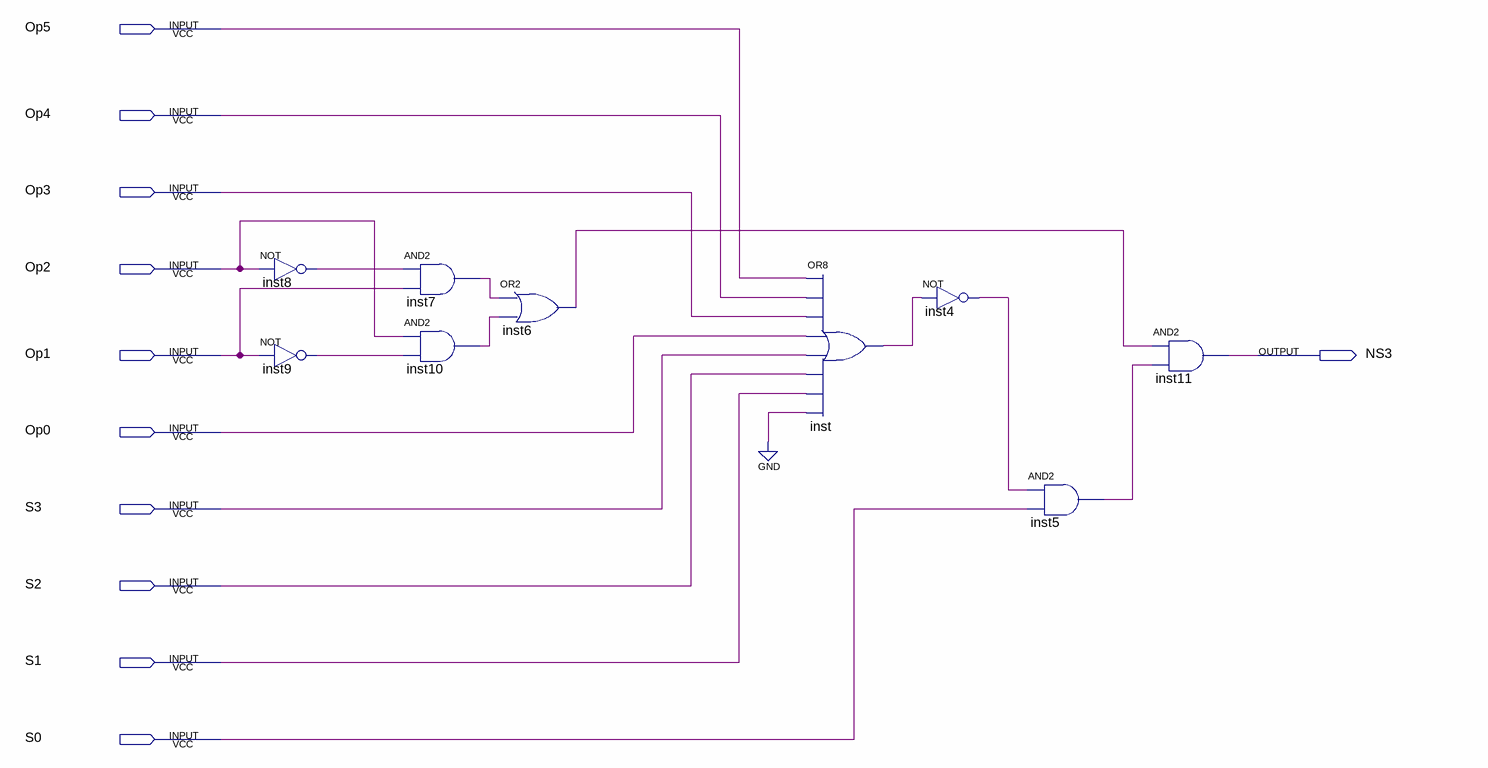
[diagram p0: schematic sheet]
// Quartus schematic NS3.bdf as structural Verilog: 9 symbols, 11 pins
module NS3 (
  input  Op5,
  input  Op4,
  input  Op3,
  input  Op2,
  input  Op1,
  input  Op0,
  input  S3,
  input  S2,
  input  S1,
  input  S0,
  output NS3
);

  wire inst4_out, inst5_out, inst6_out, inst7_out, inst8_out, inst9_out, inst10_out, inst_out;

  not inst8 (inst8_out, Op2);
  not inst9 (inst9_out, Op1);
  and inst7 (inst7_out, inst8_out, Op1);
  and inst10 (inst10_out, Op2, inst9_out);
  or inst6 (inst6_out, inst7_out, inst10_out);
  or inst (inst_out, Op5, Op4, Op3, Op0, S3, S2, S1, 1'b0);
  not inst4 (inst4_out, inst_out);
  and inst5 (inst5_out, inst4_out, S0);
  and inst11 (NS3, inst6_out, inst5_out);
endmodule
